# EAGLE design Arduino_Mini (EAGLE 8.4.3)
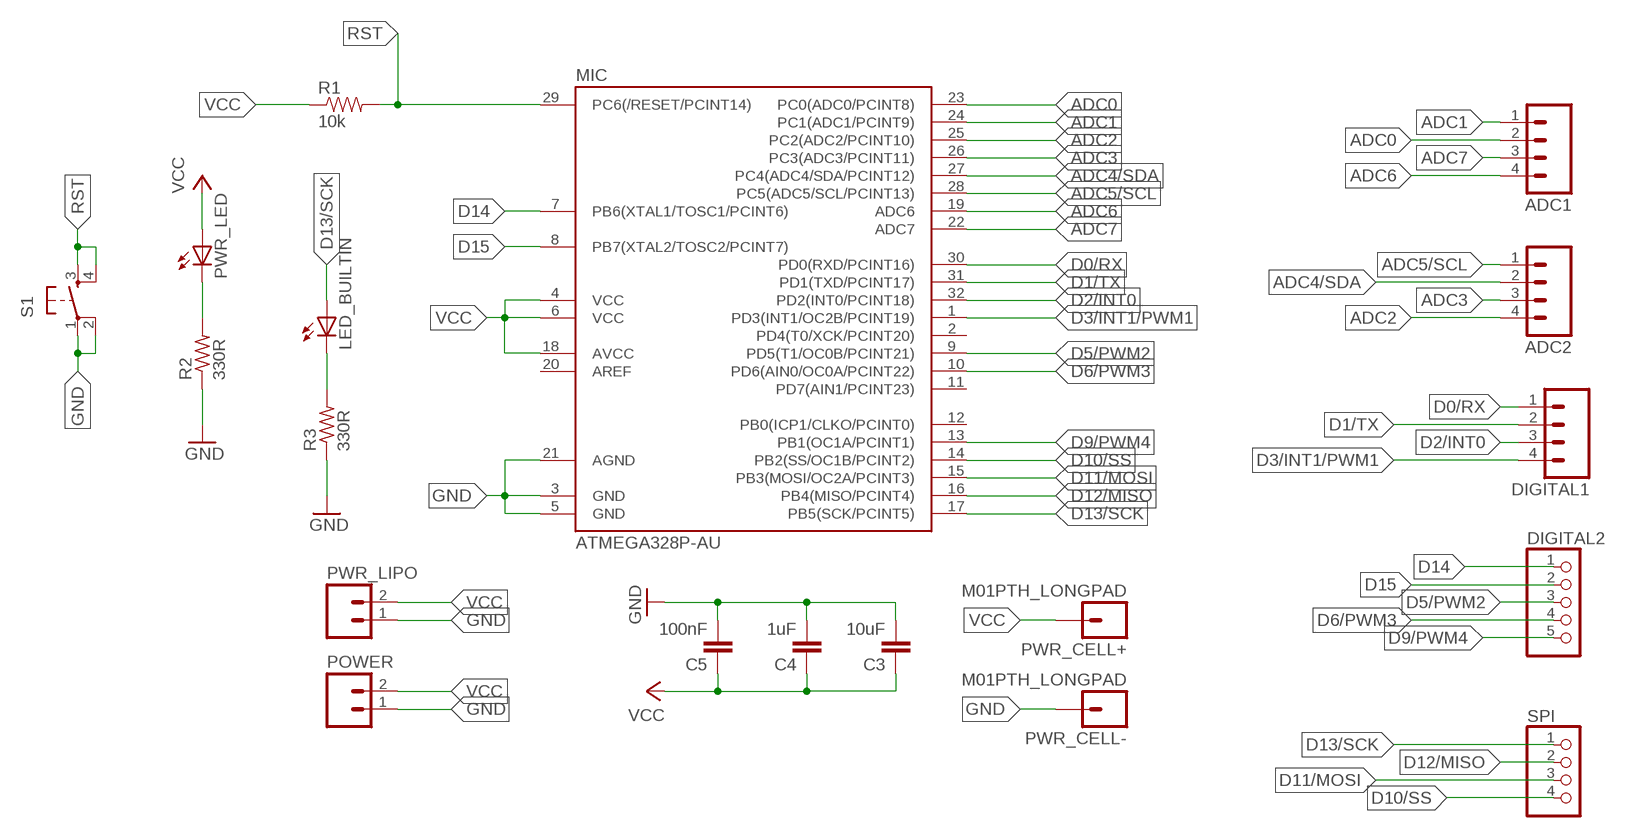
[diagram p0: schematic, sheet 1]

## Parts
ADC1  M04LONGPADS  [1X04_LONGPADS]
ADC2  M04LONGPADS  [1X04_LONGPADS]
C3  10uF  CAP1206  [1206]
C4  1uF  CAP1206  [1206]
C5  100nF  CAP1206  [1206]
DIGITAL1  M04LONGPADS  [1X04_LONGPADS]
DIGITAL2  PINHD-1X5  [1X05]
LED_BUILTIN  LED1206  [1206]
MIC  ATMEGA328P-AU  ATMEGA48/88/168-AU  [TQFP32-08]
POWER  M02LOCK_LONGPADS  [1X02_LOCK_LONGPADS]
PWR_CELL+  M01PTH_LONGPAD  [1X01_LONGPAD]
PWR_CELL-  M01PTH_LONGPAD  [1X01_LONGPAD]
PWR_LED  LED1206  [1206]
PWR_LIPO  M02LOCK_LONGPADS  [1X02_LOCK_LONGPADS]
R1  10k  RESISTOR1206  [1206]
R2  330R  RESISTOR1206  [1206]
R3  330R  RESISTOR1206  [1206]
S1  6MM_SWITCH6MM_SWITCH  [6MM_SWITCH]
SPI  PINHD-1X4  [1X04]

## Nets
ADC0: ADC1.2 MIC.23(PC0(ADC0/PCINT8))
ADC1: ADC1.1 MIC.24(PC1(ADC1/PCINT9))
ADC2: ADC2.4 MIC.25(PC2(ADC2/PCINT10))
ADC3: ADC2.3 MIC.26(PC3(ADC3/PCINT11))
ADC4/SDA: ADC2.2 MIC.27(PC4(ADC4/SDA/PCINT12))
ADC5/SCL: ADC2.1 MIC.28(PC5(ADC5/SCL/PCINT13))
ADC6: ADC1.4 MIC.19(ADC6)
ADC7: ADC1.3 MIC.22(ADC7)
D0/RX: DIGITAL1.1 MIC.30(PD0(RXD/PCINT16))
D1/TX: DIGITAL1.2 MIC.31(PD1(TXD/PCINT17))
D2/INT0: DIGITAL1.3 MIC.32(PD2(INT0/PCINT18))
D3/INT1/PWM1: DIGITAL1.4 MIC.1(PD3(INT1/OC2B/PCINT19))
D5/PWM2: DIGITAL2.3 MIC.9(PD5(T1/OC0B/PCINT21))
D6/PWM3: DIGITAL2.4 MIC.10(PD6(AIN0/OC0A/PCINT22))
D9/PWM4: DIGITAL2.5 MIC.13(PB1(OC1A/PCINT1))
D10/SS: MIC.14(PB2(SS/OC1B/PCINT2)) SPI.4
D11/MOSI: MIC.15(PB3(MOSI/OC2A/PCINT3)) SPI.3
D12/MISO: MIC.16(PB4(MISO/PCINT4)) SPI.2
D13/SCK: LED_BUILTIN.1(A) MIC.17(PB5(SCK/PCINT5)) SPI.1
D14: DIGITAL2.1 MIC.7(PB6(XTAL1/TOSC1/PCINT6))
D15: DIGITAL2.2 MIC.8(PB7(XTAL2/TOSC2/PCINT7))
GND: C3.2 C4.2 C5.2 MIC.3(GND) MIC.5(GND) MIC.21(AGND) POWER.1 PWR_CELL-.1 PWR_LIPO.1 R2.1 R3.1 S1.1(P) S1.2(P1)
N$2: LED_BUILTIN.2(C) R3.2
N$3: PWR_LED.2(C) R2.2
RST: MIC.29(PC6(/RESET/PCINT14)) R1.2 S1.3(S) S1.4(S1)
VCC: C3.1 C4.1 C5.1 MIC.4(VCC) MIC.6(VCC) MIC.18(AVCC) POWER.2 PWR_CELL+.1 PWR_LED.1(A) PWR_LIPO.2 R1.1
Unconnected: MIC.2(PD4(T0/XCK/PCINT20)) MIC.11(PD7(AIN1/PCINT23)) MIC.12(PB0(ICP1/CLKO/PCINT0)) MIC.20(AREF)

## Library data of the parts
ADC1 ADC2 DIGITAL1 = flight_controller.lbr01_SparkFun:M04: Header 4 Standard 4-pin 0.1" header. Use with straight break away headers (SKU : PRT-00116), right angle break away headers (PRT-00553), swiss pins (PRT-00743), machine pins (PRT-00117), and female headers (PRT-00115). Molex polarized connector foot print use with SKU : PRT-08231 with associated crimp pins and housings.
C3-C5 = 01_SparkFun:CAP: Capacitor Standard 0603 ceramic capacitor, and 0.1" leaded capacitor.
DIGITAL2 = pinhead:PINHD-1X5: PIN HEADER
LED_BUILTIN PWR_LED = FAB_Hello:LED
MIC = atmega8:ATMEGA48/88/168
POWER PWR_LIPO = flight_controller.lbr01_SparkFun:M02: Header 2 Standard 2-pin 0.1" header. Use with straight break away headers (SKU : PRT-00116), right angle break away headers (PRT-00553), swiss pins (PRT-00743), machine pins (PRT-00117), and female headers (PRT-00115). Molex polarized connector foot print use with SKU : PRT-08233 with associated crimp pins and housings.
PWR_CELL+ PWR_CELL- = flight_controller.lbr01_SparkFun:M01: Header 1 Standard 1-pin 0.1" header. Use with straight break away headers (SKU : PRT-00116), right angle break away headers (PRT-00553), swiss pins (PRT-00743), machine pins (PRT-00117), and female headers (PRT-00115).
R1 = 01_SparkFun:RESISTOR: Resistor Basic schematic elements and footprints for 0603, 1206, and PTH 1/10th watt (small) resistors.
R2 R3 = FAB_Hello:RESISTOR
S1 = fablab:6MM_SWITCH: OMRON SWITCH
SPI = pinhead:PINHD-1X4: PIN HEADER

## Board
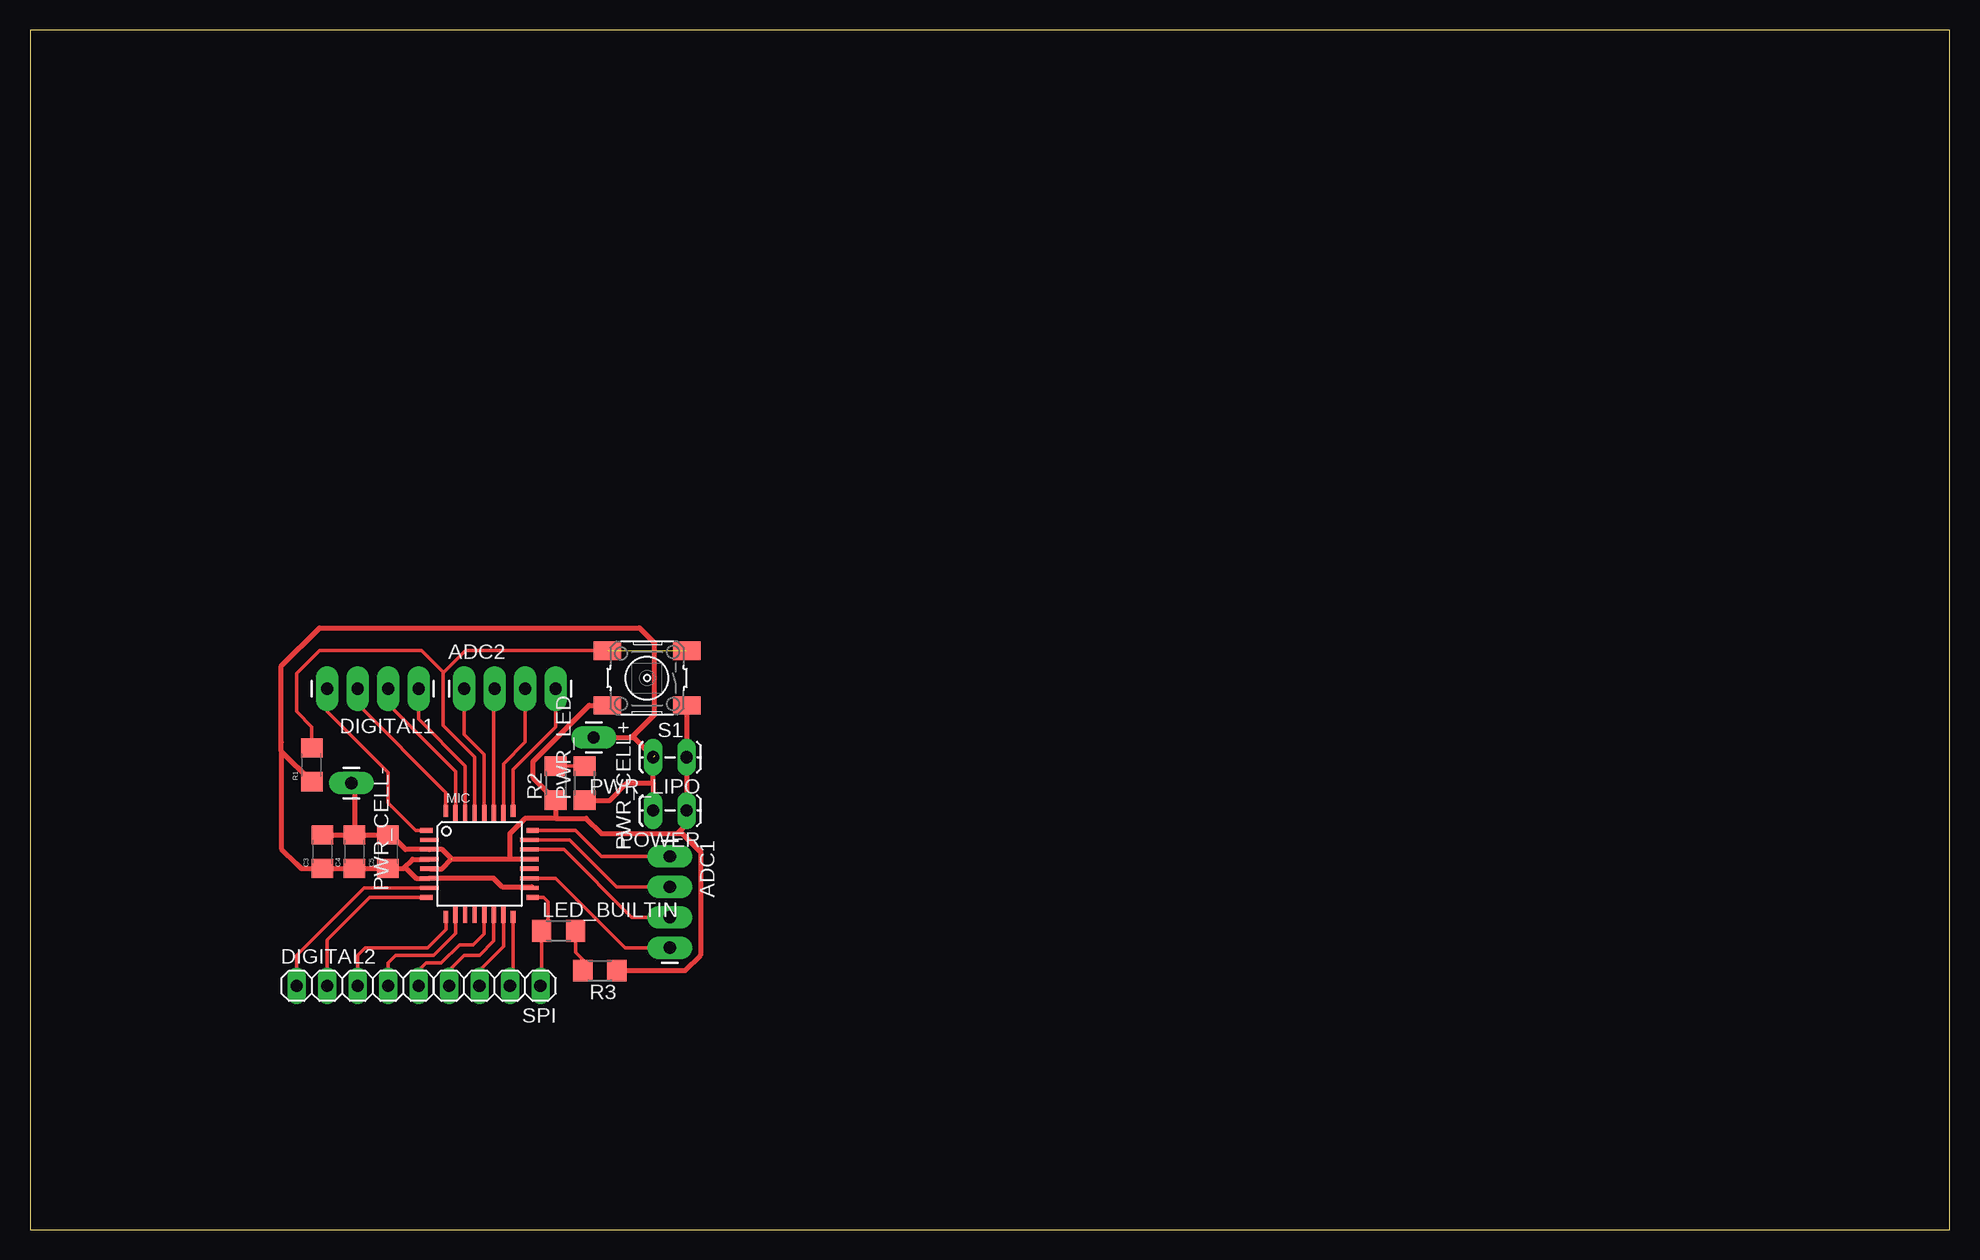
[diagram p1: board, top side]

Size 160 x 100 mm. Coordinates in mm from the lower left corner, seen from the top.
Outline: 0,0 160,0 160,100 0,100 0,0
Copper layers (1*16): Top 0.035mm / dielectric 1.5mm / Bottom 0.035mm
Design rules "default": minimum track width 6mil, minimum drill 0.35mm, track to track 6mil, track to pad 6mil, pad to pad 6mil, via to via 6mil, smd to smd 6mil, copper to edge 40mil, drill to drill 6mil, minimum pad ring 10mil, minimum via ring 8mil, stop-mask expansion 4mil, vias tented up to drill 0mil, thermal gap 10mil

### Footprints (pad centres in the part's own frame; a part is rotated, then mirrored left to right if it is on the bottom)
1X04_LONGPADS = drill 1.016 pad 1.88 long: 1 0,0; 2 2.54,0; 3 5.08,0; 4 7.62,0
1206 = smd 1.6 x 1.8: 1 -1.4,0; 2 1.4,0
1X05 = drill 1.016 long: 1 -5.08,0; 2 -2.54,0; 3 0,0; 4 2.54,0; 5 5.08,0
1206' = smd 1.6 x 1.803: 1 -1.422,0; 2 1.422,0
TQFP32-08 = smd 1.016 x 0.406: 1 -4.42,2.8; 8 -4.42,-2.8; 17 4.42,-2.8; 24 4.42,2.8 | smd 1.524 x 0.356: 2 -4.166,2; 3 -4.166,1.2; 4 -4.166,0.4; 5 -4.166,-0.4; 6 -4.166,-1.2; 7 -4.166,-2; 18 4.166,-2; 19 4.166,-1.2; 20 4.166,-0.4; 21 4.166,0.4; 22 4.166,1.2; 23 4.166,2 | smd 0.406 x 1.016: 9 -2.8,-4.42; 16 2.8,-4.42; 25 2.8,4.42; 32 -2.8,4.42 | smd 0.356 x 1.524: 10 -2,-4.166; 11 -1.2,-4.166; 12 -0.4,-4.166; 13 0.4,-4.166; 14 1.2,-4.166; 15 2,-4.166; 26 2,4.166; 27 1.2,4.166; 28 0.4,4.166; 29 -0.4,4.166; 30 -1.2,4.166; 31 -2,4.166
1X02_LOCK_LONGPADS = drill 1.016 long: 1 -0.127,0; 2 2.667,0
1X01_LONGPAD = drill 1.016 pad 1.88 long: 1 0,0
6MM_SWITCH = smd 2.286 x 1.524: 1 -3.302,2.286; 2 3.302,2.286; 3 -3.302,-2.286; 4 3.302,-2.286
1X04 = drill 1.016 long: 1 -3.81,0; 2 -1.27,0; 3 1.27,0; 4 3.81,0

### Placement (x,y rotation side)
ADC1  53.34,31.11 270 top
ADC2  36.2,45.09 0 top
C3  24.38,31.5 90 top
C4  27.05,31.5 90 top
C5  29.84,31.5 90 top
DIGITAL1  32.38,45.09 180 top
DIGITAL2  27.3,20.32 0 top
LED_BUILTIN  [1206']  44.07,24.89 0 top
MIC  37.47,30.48 0 top
POWER  54.61,34.92 180 top
PWR_CELL+  46.99,41.02 270 top
PWR_CELL-  26.8,37.21 270 top
PWR_LED  [1206']  46.23,37.21 90 top
PWR_LIPO  54.61,39.37 180 top
R1  23.5,38.73 90 top
R2  330R  [1206']  43.81,37.21 90 top
R3  330R  [1206']  47.5,21.59 180 top
S1  51.44,45.97 180 top
SPI  38.73,20.32 180 top

### Tracks (layer width: path | path; a pad name or v marks a point on that pad's centre or on a via)
ADC0
  Top 0.305: MIC.23 44.99,32.48 48.9,28.57 ADC1.2 52.07,28.57
ADC1
  Top 0.305: MIC.24 45.46,33.28 47.62,31.11 ADC1.1
ADC2
  Top 0.305: MIC.25 40.27,38.36 43.81,41.91 ADC2.4
ADC3
  Top 0.305: ADC2.3 41.27,40.64 39.47,38.83 MIC.26
ADC4/SDA
  Top 0.305: MIC.27 38.66,45.02 ADC2.2
ADC5/SCL
  Top 0.305: MIC.28 37.87,39.6 36.2,41.27 ADC2.1
ADC6
  Top 0.305: MIC.19 43.81,29.28 49.6,23.5 ADC1.4
ADC7
  Top 0.305: MIC.22 44.52,31.68 50.16,26.04 ADC1.3
D0/RX
  Top 0.305: DIGITAL1.1 32.38,42.55 36.27,38.66 MIC.30
D1/TX
  Top 0.305: DIGITAL1.2 29.84,43.81 35.47,38.2 MIC.31
D2/INT0
  Top 0.305: DIGITAL1.3 27.3,43.81 34.66,36.45 MIC.32
D3/INT1/PWM1
  Top 0.305: 32.38,33.28 32.25,33.28 | 32.38,33.28 MIC.1 | DIGITAL1.4 24.77,43.18 29.84,38.1 29.84,35.56 32.12,33.28 32.38,33.28
D5/PWM2
  Top 0.305: MIC.9 34.67,25.02 33.15,23.5 27.94,23.5 27.3,22.86 DIGITAL2.3
D6/PWM3
  Top 0.305: 35.43,26.28 MIC.10 35.47,24.67 33.66,22.86 30.48,22.86 29.84,22.23 DIGITAL2.4
D9/PWM4
  Top 0.305: 37.85,26.3 MIC.13 37.87,24.66 36.96,23.75 35.81,23.75 34.29,22.23 33.02,22.23 32.38,21.59 DIGITAL2.5
D10/SS
  Top 0.305: SPI.4 34.92,21.59 36.2,22.86 37.47,22.86 38.66,24.06 MIC.14
D11/MOSI
  Top 0.305: MIC.15 39.47,23.59 37.47,21.59 SPI.3
D12/MISO
  Top 0.305: MIC.16 40.27,20.58 SPI.2
D13/SCK
  Top 0.305: MIC.17 42.8,27.68 43.18,27.3 43.18,25.43 LED_BUILTIN.1 42.65,20.42 SPI.1 42.77,20.55
D14
  Top 0.305: DIGITAL2.1 22.23,22.86 27.84,28.48 MIC.7
D15
  Top 0.305: MIC.8 31.11,27.68 | 31.11,27.68 30.86,27.68 | 31.11,27.68 28.32,27.68 24.77,24.13 DIGITAL2.2
GND  (1 unrouted)
  Top 0.305: 54.74,34.16 54.74,33.78 | 30.48,32.51 30.48,32.52 | 54.61,35.05 POWER.1 | S1.2 47.24,43.81
  Top 0.406: 35.18,30.86 34.36,31.68 MIC.3 31.31,31.68 30.48,32.51 | 40.01,30.88 35.16,30.88 34.36,30.08 MIC.5 | 40.01,30.88 MIC.21 | 40.01,30.88 40.01,33.02 41.27,34.29 43.81,34.29 | 43.81,34.29 46.35,34.29 47.62,33.02 53.98,33.02 | 54.74,33.78 53.98,33.02 | 54.74,34.16 POWER.1 PWR_LIPO.1 S1.1 | C4.2 C5.2 30.48,32.52 | R3.1 54.61,21.59 55.88,22.86 55.88,31.5 54.36,33.02 53.98,33.02 | S1.2 46.61,43.69 41.91,38.99 41.91,37.69 R2.1 43.81,34.29 | PWR_CELL-.1 27.05,36.96 C4.2 | C3.2 C4.2
N$2
  Top 0.305: LED_BUILTIN.2 45.49,23.09 46.35,22.23 46.35,21.87 R3.2
N$3
  Top 0.305: R2.2 PWR_LED.2
RST  (1 unrouted)
  Top 0.305: MIC.29 37.06,39.39 34.42,42.04 34.42,46.35 | 34.42,46.35 34.42,46.48 | 34.48,46.42 34.42,46.35 | 34.48,46.42 36.32,48.26 S1.4 | R1.2 23.5,41.91 22.23,43.18 22.23,46.35 24.13,48.26 32.64,48.26 34.48,46.42
VCC  (1 unrouted)
  Top 0.305: MIC.18 41.91,28.48 41.81,28.57 | C5.1 29.98,30.48 | 33.28,30.86 MIC.4 | 31.11,30.1 31.37,30.1
  Top 0.406: 41.81,28.57 39.37,28.57 38.66,29.28 MIC.6 32.19,29.28 31.37,30.1 | 33.28,30.86 31.88,30.86 31.11,30.1 C5.1 C4.1 C3.1 22.61,30.1 22.54,30.16 22.23,30.48 20.95,31.75 20.95,39.88 | 51.94,37.21 PWR_LIPO.2 50.29,41.02 50.16,41.02 | 51.94,37.21 POWER.2 | PWR_CELL+.1 50.16,41.02 | PWR_LED.1 48.36,35.79 49.78,37.21 51.94,37.21 | 20.95,39.88 R1.1 | 20.95,39.88 20.95,40.64 20.95,46.99 24.13,50.16 50.8,50.16 52.07,48.9 52.07,42.93 50.16,41.02